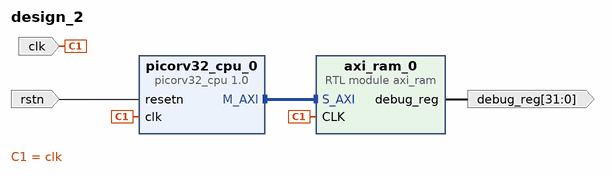
[diagram p0: block diagram of the top level]
# Vivado block design design_2, xc7a100tcsg324-1, Vivado 2023.2
create_bd_design design_2

create_bd_port -dir I -type clk clk
set_property -dict {CONFIG.FREQ_HZ 100000000} [get_bd_ports clk]
create_bd_port -dir I rstn
create_bd_port -dir O -from 31 -to 0 debug_reg

create_bd_cell -type ip -vlnv xilinx.com:user:picorv32_cpu:1.0 picorv32_cpu_0
create_bd_cell -type module -reference axi_ram axi_ram_0

# ---- connections ----

connect_bd_intf_net [get_bd_intf_pins picorv32_cpu_0/M_AXI] [get_bd_intf_pins axi_ram_0/S_AXI]
connect_bd_net [get_bd_pins axi_ram_0/debug_reg] [get_bd_ports debug_reg]
connect_bd_net [get_bd_ports clk] [get_bd_pins axi_ram_0/CLK] [get_bd_pins picorv32_cpu_0/clk]
connect_bd_net [get_bd_ports rstn] [get_bd_pins picorv32_cpu_0/resetn]

# ---- address map ----
assign_bd_address -offset 0x0000 -range 64K -target_address_space [get_bd_addr_spaces picorv32_cpu_0/M_AXI] [get_bd_addr_segs axi_ram_0/S_AXI/reg0]

validate_bd_design
save_bd_design
